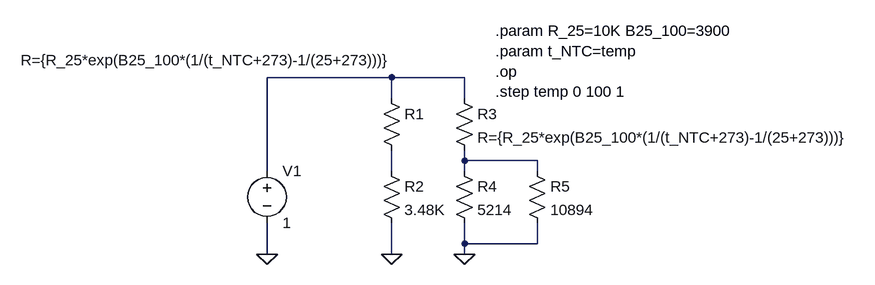
[diagram p0: schematic ntc_thermistor.asc]
ntc_thermistor.asc, the LTspice schematic file:
Version 4
SHEET 1 1080 680
WIRE 272 -32 80 -32
WIRE 384 -32 272 -32
WIRE 272 0 272 -32
WIRE 384 0 384 -32
WIRE 384 96 384 80
WIRE 496 96 384 96
WIRE 80 112 80 -32
WIRE 272 112 272 80
WIRE 384 112 384 96
WIRE 496 112 496 96
WIRE 384 224 384 192
WIRE 496 224 496 192
WIRE 496 224 384 224
WIRE 80 240 80 192
WIRE 272 240 272 192
WIRE 384 240 384 224
FLAG 80 240 0
FLAG 272 240 0
FLAG 384 240 0
SYMBOL voltage 80 96 R0
WINDOW 123 0 0 Left 0
WINDOW 39 0 0 Left 0
SYMATTR InstName V1
SYMATTR Value 1
SYMBOL res 256 -16 R0
WINDOW 3 -555 -43 Left 2
SYMATTR InstName R1
SYMATTR Value R={R_25*exp(B25_100*(1/(t_NTC+273)-1/(25+273)))}
SYMBOL res 256 96 R0
SYMATTR InstName R2
SYMATTR Value 3.48K
SYMBOL res 368 -16 R0
SYMATTR InstName R3
SYMATTR Value R={R_25*exp(B25_100*(1/(t_NTC+273)-1/(25+273)))}
SYMBOL res 368 96 R0
SYMATTR InstName R4
SYMATTR Value 5214
SYMBOL res 480 96 R0
SYMATTR InstName R5
SYMATTR Value 10894
TEXT 432 -104 Left 2 !.param R_25=10K B25_100=3900\n.param t_NTC=temp\n.op\n.step temp 0 100 1

The netlist it stands for:
* ntc_thermistor.asc
V1 N001 0 1
R1 N001 N003 R={R_25*exp(B25_100*(1/(t_NTC+273)-1/(25+273)))}
R2 N003 0 3.48K
R3 N001 N002 R={R_25*exp(B25_100*(1/(t_NTC+273)-1/(25+273)))}
R4 N002 0 5214
R5 N002 0 10894
.param R_25=10K B25_100=3900
.param t_NTC=temp
.op
.step temp 0 100 1
.backanno
.end